# EasyEDA Pro project LUME_PEN_EasyEDA_Project_V1.2_2026-06-28.epro, board LUME_PCB_PANEL
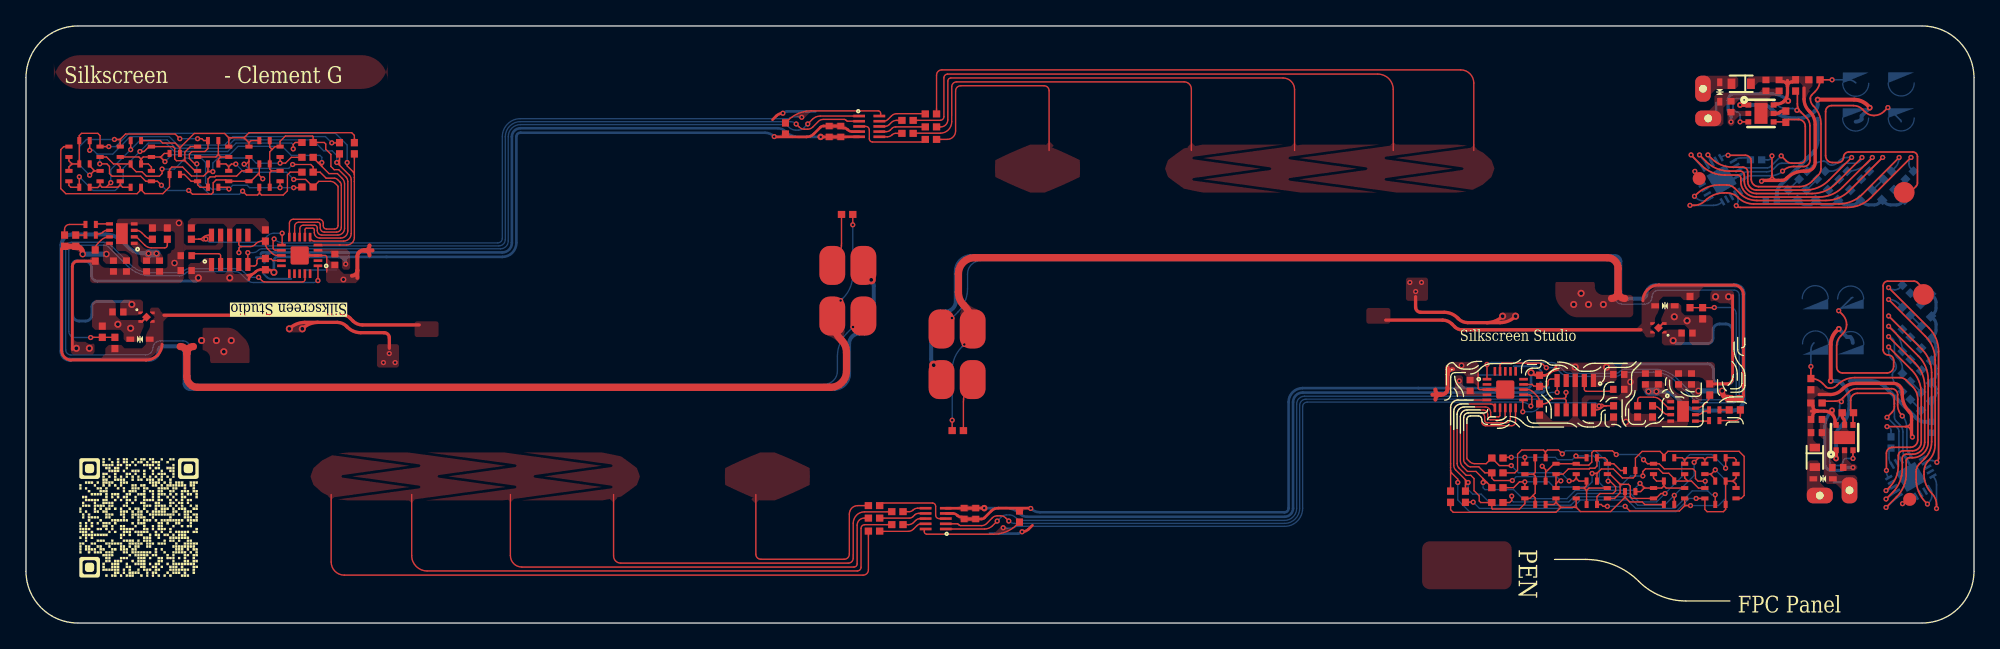
[diagram p9: board, top side]
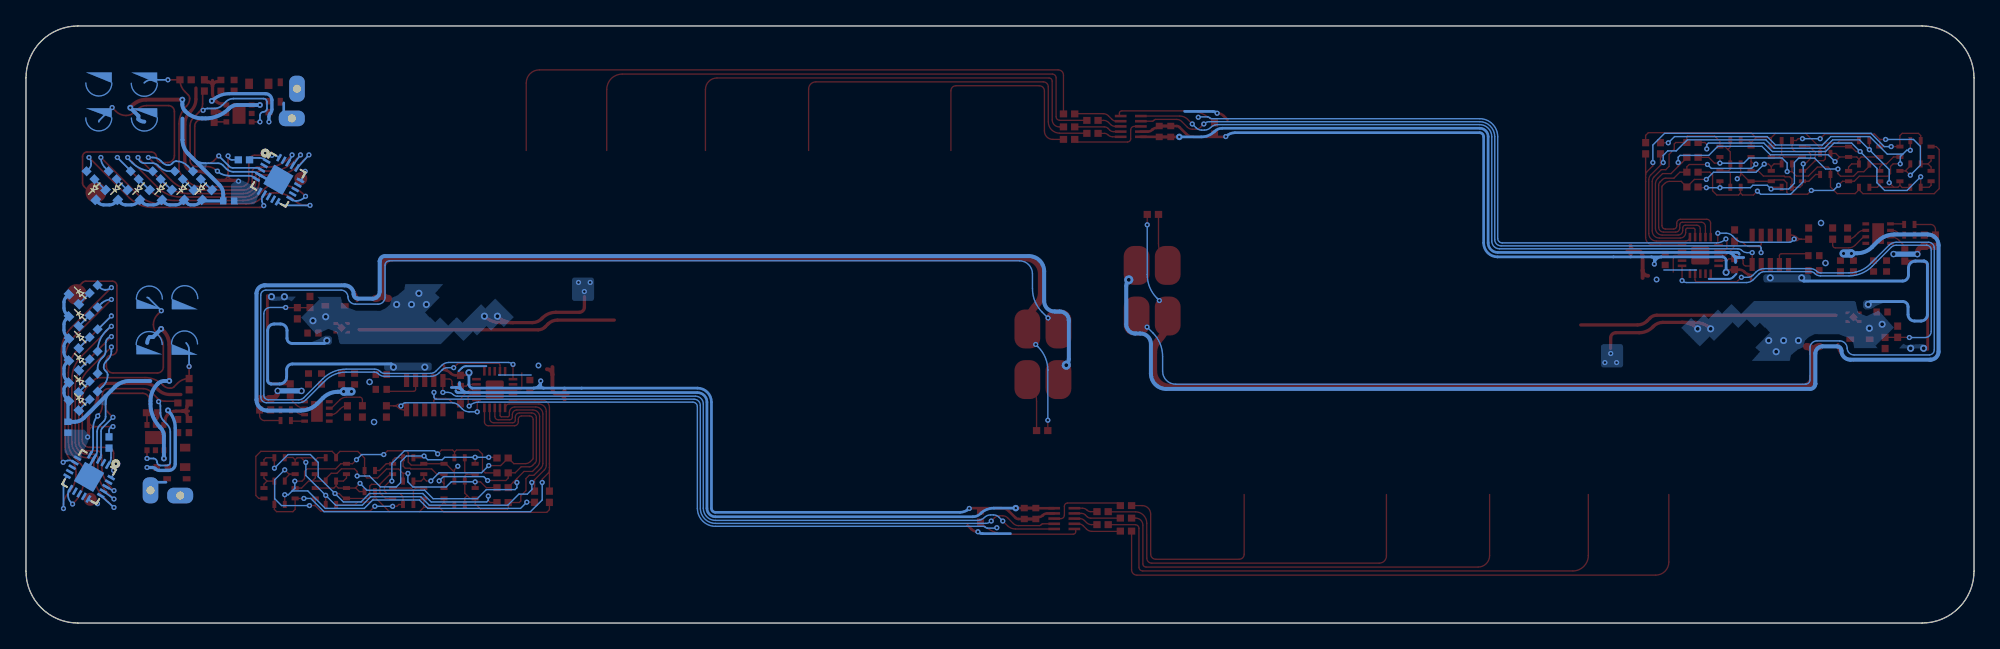
[diagram p10: board, bottom side, seen from below]

Outline 150 x 46 mm; copper layers: Top Layer, Bottom Layer. Coordinates in mm from the lower left corner of the outline.
Outline path: 0,42 0,4 arc(1.17,1.17) 4,0 146,0 arc(148.83,1.17) 150,4 150,42 arc(148.83,44.83) 146,46 4,46 arc(1.17,44.83) 0,42
Stack: Top Layer 0.035mm / Dielectric1 1.51mm FR4 er 4.5 / Bottom Layer 0.035mm

## Design rules (mm)
template: Custom Config
spacing copperThickness1oz (default): track to track 0.127, other pairs 0.15 to 0.3
spacing copperThickness2oz: track to track 0.203, other pairs 0.152 to 0.3
track width copperThickness1oz (default): min 0.102, default 0.102, max 2.54
track width copperThickness2oz: min 0.203, default 0.254, max 2.54
differential pair differentialPair (default): width min 0.127, default 0.254, max 2.54; gap min 0.152, default 0.152
via viaSize (default): diameter min 0.35, default 0.4, max 10; hole min 0.15, default 0.2, max 6.3
pour e689 uses copperRegion1
pour e1654 uses GND pour
pour e1473 uses SENSE_TRACES
pour e12839 uses copperRegion

## Placement (name value [footprint] x y rotation side)
C1  1µF  [C0402]  12.33 28.3 180 top
C1#2  -  [C0402]  137.87 15.69 0 top
C1#3  -  [C0402]  134.99 41.42 270 top
C1#4  -  [C0402]  122.65 18 0 top
C2  100nF  [C0402]  23.78 28.01 270 top
C2#2  -  [C0402]  137.87 14.67 0 top
C2#3  -  [C0402]  133.98 41.42 270 top
C2#4  -  [C0402]  111.2 18.3 90 top
C3  100nF  [C0402]  12.33 27.15 180 top
C3#2  -  [C0402]  122.65 19.15 0 top
C3#3  -  [C0402]  146.77 15.08 90 bottom
C3#4  -  [C0402]  134.39 32.52 0 bottom
C4  -  [C0402]  139.51 11.98 180 top
C4#2  -  [C0402]  131.29 39.78 90 top
C5  4.7µF  [C0402]  9.28 27.5 270 top
C5#2  -  [C0402]  125.7 18.8 90 top
C6  4.7µF  [C0402]  127.25 18.8 90 top
C6#2  -  [C0402]  7.73 27.5 270 top
C7  100nF  [C0402]  124.7 18.8 90 top
C7#2  -  [C0402]  10.28 27.5 270 top
C8  100nF  [C0402]  128.25 18.8 90 top
C8#2  -  [C0402]  6.73 27.5 270 top
C9  100nF  [C0402]  62.74 37.87 270 top
C9#2  -  [C0402]  72.24 8.44 90 top
C10  1µF  [C0402]  61.85 37.87 270 top
C10#2  -  [C0402]  73.13 8.44 90 top
C11  1µF  [C0402]  7.08 23.97 180 top
C11#2  -  [C0402]  127.9 22.34 0 top
D1  LESD5D5.0CT1G  [SOD-523_L1.2-W0.8-LS1.6-BI]  8.78 21.87 0 top
D1#2  -  [SOD-523_L1.2-W0.8-LS1.6-BI]  126.2 24.44 180 top
D3  -  [SOD-523F_L1.7-W0.9-LS1.7-RD]  137.74 12.76 270 top
D3#2  -  [SOD-523F_L1.7-W0.9-LS1.7-RD]  132.07 41.55 180 top
LED1  XL-1005SURC  [LED0402]  4.98 29.89 180 top
LED1#2  -  [LED0402]  130 16.42 0 top
LED1#3  -  [LED0402-RD_YELLOW]  146.31 16.75 225 bottom
LED1#4  -  [LED0402-RD_YELLOW]  136.06 32.98 135 bottom
LED2  XL-1005SURC  [LED0402]  4.98 30.71 180 top
LED2#2  -  [LED0402]  130 15.6 0 top
LED2#3  -  [LED0402-RD_YELLOW]  146.31 18.14 225 bottom
LED2#4  -  [LED0402-RD_YELLOW]  137.45 32.98 135 bottom
LED3  XL-1005SURC  [LED0402]  13.21 34.44 90 top
LED3#2  -  [LED0402]  121.77 11.87 270 top
LED3#3  -  [LED0402-RD_YELLOW]  146.31 19.84 225 bottom
LED3#4  -  [LED0402-RD_YELLOW]  139.15 32.98 135 bottom
LED4  XL-1005SURC  [LED0402]  13.22 36.31 90 top
LED4#2  -  [LED0402]  121.77 10 270 top
LED4#3  -  [LED0402-RD_YELLOW]  146.31 21.54 225 bottom
LED4#4  -  [LED0402-RD_YELLOW]  140.85 32.98 135 bottom
LED5  XL-1005SURC  [LED0402]  9.66 36.31 90 top
LED5#2  -  [LED0402]  125.32 10 270 top
LED5#3  -  [LED0402-RD_YELLOW]  146.31 23.24 225 bottom
LED5#4  -  [LED0402-RD_YELLOW]  142.55 32.98 135 bottom
LED6  XL-1005SURC  [LED0402]  4.51 33.57 180 top
LED6#2  -  [LED0402]  130.47 12.73 0 top
LED6#3  -  [LED0402-RD_YELLOW]  146.31 24.94 225 bottom
LED6#4  -  [LED0402-RD_YELLOW]  144.25 32.98 135 bottom
LED7  XL-1005SURC  [LED0402]  3.3 34.44 270 top
LED7#2  -  [LED0402]  131.68 11.87 90 top
LED8  XL-1005SURC  [LED0402]  18.37 33.57 180 top
LED8#2  -  [LED0402]  116.61 12.74 0 top
LED9  XL-1005SURC  [LED0402]  14.41 37.17 180 top
LED9#2  -  [LED0402]  120.57 9.14 0 top
LED10  XL-1005SURC  [LED0402]  7.26 36.31 90 top
LED10#2  -  [LED0402]  127.72 10 270 top
LED11  XL-1005SURC  [LED0402]  5.71 34.43 90 top
LED11#2  -  [LED0402]  129.27 11.87 270 top
LED12  XL-1005SURC  [LED0402]  4.51 35.37 0 top
LED12#2  -  [LED0402]  130.47 10.94 180 top
LED13  XL-1005SURC  [LED0402]  19.56 34.44 270 top
LED13#2  -  [LED0402]  115.42 11.87 90 top
LED14  XL-1005SURC  [LED0402]  14.41 33.57 0 top
LED14#2  -  [LED0402]  120.57 12.74 180 top
LED15  XL-1005SURC  [LED0402]  8.46 35.37 180 top
LED15#2  -  [LED0402]  126.52 10.94 0 top
LED16  XL-1005SURC  [LED0402]  7.26 34.44 90 top
LED16#2  -  [LED0402]  127.72 11.87 270 top
LED17  XL-1005SURC  [LED0402]  5.71 36.31 270 top
LED17#2  -  [LED0402]  129.27 10 90 top
LED18  XL-1005SURC  [LED0402]  19.57 36.31 270 top
LED18#2  -  [LED0402]  115.41 10 90 top
LED19  XL-1005SURC  [LED0402]  11.45 34.56 180 top
LED19#2  -  [LED0402]  123.53 11.75 0 top
LED20  XL-1005SURC  [LED0402]  14.41 35.37 180 top
LED20#2  -  [LED0402]  120.57 10.94 0 top
LED21  XL-1005SURC  [LED0402]  8.46 33.57 0 top
LED21#2  -  [LED0402]  126.52 12.74 180 top
LED22  XL-1005SURC  [LED0402]  3.31 36.31 90 top
LED22#2  -  [LED0402]  131.67 10 270 top
LED23  XL-1005SURC  [LED0402]  18.37 35.37 180 top
LED23#2  -  [LED0402]  116.61 10.94 0 top
LED24  XL-1005SURC  [LED0402]  17.17 34.44 270 top
LED24#2  -  [LED0402]  117.81 11.87 90 top
LED25  XL-1005SURC  [LED0402]  15.61 34.44 270 top
LED25#2  -  [LED0402]  119.37 11.87 90 top
LED26  XL-1005SURC  [LED0402]  9.66 34.43 270 top
LED26#2  -  [LED0402]  125.32 11.87 90 top
LED27  XL-1005SURC  [LED0402]  4.51 37.17 0 top
LED27#2  -  [LED0402]  130.47 9.14 180 top
LED28  XL-1005SURC  [LED0402]  18.37 37.17 180 top
LED28#2  -  [LED0402]  116.61 9.14 0 top
LED29  XL-1005SURC  [LED0402]  17.17 36.31 90 top
LED29#2  -  [LED0402]  117.81 10 270 top
LED30  XL-1005SURC  [LED0402]  15.61 36.31 90 top
LED30#2  -  [LED0402]  119.37 10 270 top
LED31  XL-1005SURC  [LED0402]  11.45 36.18 0 top
LED31#2  -  [LED0402]  123.53 10.13 180 top
LED32  XL-1005SURC  [LED0402]  8.46 37.17 0 top
LED32#2  -  [LED0402]  126.52 9.14 180 top
NOREF  -  [Pad_e530]  70.5 18.75 0 top
NOREF#2  -  [Pad_e528]  72.89 18.75 0 top
NOREF#3  -  [Pad_e533]  70.5 22.65 0 top
NOREF#4  -  [Pad_e13341]  138.13 9.82 270 top
NOREF#5  -  [Pad_e1524]  140.89 41.5 0 top
NOREF#6  -  [Pad_e1520]  128.84 34.24 0 top
NOREF#7  -  [Pad_e1530]  129.13 41.17 180 top
NOREF#8  -  [Pad_e12764]  64.48 23.65 180 top
NOREF#9  -  [Pad_e14023]  140.5 25.09 270 top
NOREF#10  -  [Pad_e1529]  144.39 41.52 0 top
NOREF#11  -  [Pad_e1521]  144.62 33.18 0 top
NOREF#12  -  [Pad_e1525]  140.89 38.78 180 top
NOREF#13  -  [Pad_e14021]  137.79 21.59 90 top
NOREF#14  -  [Pad_e1526]  144.39 38.79 180 top
NOREF#15  -  [Pad_e1531]  129.53 38.88 90 top
NOREF#16  -  [Pad_e14020]  137.77 25.08 90 top
NOREF#17  -  [Pad_e12763]  64.48 27.55 180 top
NOREF#18  -  [Pad_e14022]  140.51 21.58 270 top
NOREF#19  -  [Pad_e13342]  140.41 10.22 180 top
NOREF#20  -  [Pad_e12765]  62.09 23.65 180 top
NOREF#21  -  [Pad_e531]  72.89 22.65 0 top
NOREF#22  -  [Pad_e13336]  146.11 25.31 90 top
NOREF#23  -  [Pad_e12766]  62.09 27.55 180 top
NOREF#24  -  [Pad_e13335]  145.05 9.53 90 top
R1  4.7K  [R0402]  18.44 27.65 270 top
R1#2  -  [R0402]  137.87 16.95 180 top
R1#3  -  [R0402]  116.55 18.65 90 top
R1#4  -  [R0402]  136.26 41.42 90 top
R2  4.7K  [R0402]  18.44 29.85 90 top
R2#2  -  [R0402]  140.28 16.2 0 top
R2#3  -  [R0402]  135.51 39.01 270 top
R2#4  -  [R0402]  116.55 16.45 270 top
R3  20K  [R0402]  12.73 30 90 top
R3#2  -  [R0402]  122.25 16.3 270 top
R3#3  -  [R0402]  143.61 13.91 90 bottom
R3#4  -  [R0402]  133.22 35.68 0 bottom
R4  24K  [R0402]  10.88 30 270 top
R4#2  -  [R0402]  124.1 16.3 90 top
R4#3  -  [R0402]  144.79 17.53 315 bottom
R4#4  -  [R0402]  136.84 34.5 225 bottom
R5  27K  [R0402]  5.33 28.32 90 top
R5#2  -  [R0402]  129.65 17.99 270 top
R5#3  -  [R0402]  144.79 18.92 315 bottom
R5#4  -  [R0402]  138.23 34.5 225 bottom
R6  10K  [R0402]  9.73 30 270 top
R6#2  -  [R0402]  125.25 16.3 90 top
R6#3  -  [R0402]  144.79 20.62 315 bottom
R6#4  -  [R0402]  139.93 34.5 225 bottom
R7  10K  [R0402]  3.83 29.46 270 top
R7#2  -  [R0402]  131.15 16.85 90 top
R7#3  -  [R0402]  144.79 22.32 315 bottom
R7#4  -  [R0402]  141.63 34.5 225 bottom
R8  10K  [R0402]  2.97 29.46 270 top
R8#2  -  [R0402]  132.01 16.85 90 top
R8#3  -  [R0402]  144.79 24.02 315 bottom
R8#4  -  [R0402]  143.33 34.5 225 bottom
R9  0  [R0402]  69.68 39.22 180 top
R9#2  -  [R0402]  65.3 7.08 0 top
R9#3  -  [R0402]  144.79 25.72 315 bottom
R9#4  -  [R0402]  145.03 34.5 225 bottom
R10  0  [R0402]  67.88 38.73 180 top
R10#2  -  [R0402]  137.44 18.4 270 top
R10#3  -  [R0402]  137.71 41.85 180 top
R10#4  -  [R0402]  67.1 7.58 0 top
R11  0  [R0402]  69.68 38.22 180 top
R11#2  -  [R0402]  65.3 8.08 0 top
R12  0  [R0402]  67.88 37.73 180 top
R12#2  -  [R0402]  67.1 8.58 0 top
R13  0  [R0402]  69.68 37.26 0 top
R13#2  -  [R0402]  65.3 9.05 180 top
R14  20K  [R0402]  58.48 38.1 270 top
R14#2  -  [R0402]  76.5 8.21 90 top
R15  680  [R0402]  21.68 37.02 0 top
R15#2  -  [R0402]  113.3 9.28 180 top
R16  680  [R0402]  21.68 34.74 0 top
R16#2  -  [R0402]  113.3 11.57 180 top
R17  680  [R0402]  21.68 33.59 0 top
R17#2  -  [R0402]  113.3 12.71 180 top
R18  680  [R0402]  21.68 35.88 0 top
R18#2  -  [R0402]  113.3 10.43 180 top
R19  680  [R0402]  24.14 36.58 270 top
R19#2  -  [R0402]  110.84 9.73 90 top
R20  680  [R0402]  25.29 36.58 270 top
R20#2  -  [R0402]  109.69 9.73 90 top
R21  100K  [R0402]  6.85 21.58 270 top
R21#2  -  [R0402]  128.13 24.73 90 top
R22  200K  [R0402]  5.88 22.44 270 top
R22#2  -  [R0402]  129.1 23.86 90 top
R23  20K  [R0402]  63.23 31.48 180 top
R23#2  -  [R0402]  71.75 14.83 0 top
TVS1  -  [SOD-523_L1.2-W0.8-LS1.6-BI]  138.38 11.11 180 top
TVS1#2  -  [SOD-523_L1.2-W0.8-LS1.6-BI]  130.42 40.91 90 top
U1  RX8111CE B  [OSC-SMD_10P-L3.2-W2.5-BL-1]  15.69 28.75 0 top
U1#2  -  [OSC-SMD_10P-L3.2-W2.5-BL-1]  119.3 17.55 180 top
U1#3  -  [WSON-6_L2.0-W2.0-P0.65-BL-EP]  140.03 14.29 0 top
U1#4  -  [WSON-6_L2.0-W2.0-P0.65-BL-EP]  133.59 39.26 270 top
U2  ATTINY1616-MNR  [QFN-20_L3.0-W3.0-P0.40-BL-EP1.7]  113.9 17.99 270 top
U2#2  -  [QFN-20_L3.0-W3.0-P0.40-BL-EP1.7]  21.08 28.32 90 top
U2#3  -  [QFN-20_L3.0-W3.0-P0.40-TL-EP1.7]  145.14 11.26 300 bottom
U2#4  -  [QFN-20_L3.0-W3.0-P0.40-TL-EP1.7]  130.56 34.15 210 bottom
U3  BQ25170DSGR  [WSON-8_L2.0-W2.0-P0.50-TL-EP]  7.38 30 180 top
U3#2  -  [WSON-8_L2.0-W2.0-P0.50-TL-EP]  127.6 16.3 0 top
U4  -  [AW93105DNR]  64.93 38.26 270 top
U4#2  -  [AW93105DNR]  70.05 8.05 90 top
U5  LP5907SNX-3.0/NOPB  [X2SON-4_L1.0-W1.0-P0.65-BL-EP]  9.28 23.57 270 top
U5#2  -  [X2SON-4_L1.0-W1.0-P0.65-BL-EP]  125.7 22.74 90 top

## Footprints (pads in the part's own frame, mm; a bottom-side part is the same pattern mirrored in y, then rotated)
AW93105DNR
  rect 0.2x0.905 smd: 1(-0.8,-0.777) 2(-0.4,-0.777) 3(0,-0.777) 4(0.4,-0.777) 5(0.8,-0.777) 6(0.8,0.777) 7(0.4,0.777) 8(0,0.777) 9(-0.4,0.777) 10(-0.8,0.777)
C0402
  rect 0.5x0.54 smd: 1(-0.42,0) 2(0.42,0)
LED0402
  rect 0.3x0.55 smd: 1(-0.4,0) 2(0.4,0)
LED0402-RD_YELLOW
  rect 0.636x0.54 smd: 1(-0.538,0) 2(0.538,0)
OSC-SMD_10P-L3.2-W2.5-BL-1
  rect 0.4x1 smd: 1(-1.4,-1.13) 2(-0.7,-1.13) 3(0,-1.13) 4(0.7,-1.13) 5(1.4,-1.13) 6(1.4,1.13) 7(0.7,1.13) 8(0,1.13) 9(-0.7,1.13) 10(-1.4,1.13)
Pad_e528
  rrect 1.988x3 smd: 2(0,0)
Pad_e530
  rrect 1.988x3 smd: 2(0,0)
Pad_e531
  rrect 1.988x3 smd: 2(0,0)
Pad_e533
  rrect 1.988x3 smd: 2(0,0)
Pad_e1520
  round 1 smd: 1(0,0)
Pad_e1521
  round 1.6 smd: 1(0,0)
Pad_e1524
  custom 2.005x1.835 smd far side: 22(0,0)
Pad_e1525
  custom 2.01x1.758 smd far side: 22(0,0)
Pad_e1526
  custom 2.005x1.751 smd far side: 22(0,0)
Pad_e1529
  custom 2.003x1.822 smd far side: 22(0,0)
Pad_e1530
  rrect 1.2x2 hole 0.6: 1(0,0)
Pad_e1531
  rrect 1.2x2 hole 0.6: 1(0,0)
Pad_e12763
  rrect 1.988x3 smd: 2(0,0)
Pad_e12764
  rrect 1.988x3 smd: 2(0,0)
Pad_e12765
  rrect 1.988x3 smd: 2(0,0)
Pad_e12766
  rrect 1.988x3 smd: 2(0,0)
Pad_e13335
  round 1 smd: 1(0,0)
Pad_e13336
  round 1.6 smd: 1(0,0)
Pad_e13341
  rrect 1.2x2 hole 0.6: 1(0,0)
Pad_e13342
  rrect 1.2x2 hole 0.6: 1(0,0)
Pad_e14020
  custom 1.822x2.003 smd far side: 22(0,0)
Pad_e14021
  custom 1.836x2.005 smd far side: 22(0,0)
Pad_e14022
  custom 1.758x2.01 smd far side: 22(0,0)
Pad_e14023
  custom 1.751x2.005 smd far side: 22(0,0)
QFN-20_L3.0-W3.0-P0.40-BL-EP1.7
  rect 0.2x0.665 smd: 1(-0.8,-1.407) 2(-0.4,-1.407) 3(0,-1.407) 4(0.4,-1.407) 5(0.8,-1.407) 11(0.8,1.407) 12(0.4,1.407) 13(0,1.407) 14(-0.4,1.407) 15(-0.8,1.407)
  rect 0.665x0.2 smd: 6(1.407,-0.8) 7(1.407,-0.4) 8(1.407,0) 9(1.407,0.4) 10(1.407,0.8) 16(-1.407,0.8) 17(-1.407,0.4) 18(-1.407,0) 19(-1.407,-0.4) 20(-1.407,-0.8)
  rrect 1.4x1.4 smd: 21(0,0)
QFN-20_L3.0-W3.0-P0.40-TL-EP1.7
  rect 0.6x0.2 smd: 1(-1.5,0.8) 2(-1.5,0.401) 3(-1.5,0) 4(-1.5,-0.4) 5(-1.5,-0.8) 11(1.5,-0.8) 12(1.5,-0.4) 13(1.5,0) 14(1.5,0.401) 15(1.5,0.8)
  rect 0.2x0.6 smd: 6(-0.8,-1.5) 7(-0.4,-1.5) 8(0,-1.5) 9(0.4,-1.5) 10(0.799,-1.5) 16(0.8,1.5) 17(0.4,1.5) 18(0,1.5) 19(-0.4,1.5) 20(-0.8,1.5)
  rect 1.7x1.7 smd: 21(0,0)
R0402
  rect 0.566x0.54 smd: 1(-0.433,0) 2(0.433,0)
SOD-523_L1.2-W0.8-LS1.6-BI
  rect 0.6x0.4 smd: 1(-0.75,0) 2(0.75,0)
SOD-523F_L1.7-W0.9-LS1.7-RD
  rect 0.6x0.8 smd: 1(-0.75,0) 2(0.75,0)
WSON-6_L2.0-W2.0-P0.65-BL-EP
  rect 0.4x0.45 smd: 1(-0.65,-0.975) 2(0,-0.975) 3(0.65,-0.975) 4(0.65,0.975) 5(0,0.975) 6(-0.65,0.975)
  rect 1.6x1 smd: 7(0,0)
WSON-8_L2.0-W2.0-P0.50-TL-EP
  rect 0.521x0.25 smd: 1(-0.95,0.75) 2(-0.95,0.25) 3(-0.95,-0.25) 4(-0.95,-0.75) 5(0.95,-0.75) 6(0.95,-0.25) 7(0.95,0.25) 8(0.95,0.75)
  rect 0.9x1.6 smd: 9(0,0)
X2SON-4_L1.0-W1.0-P0.65-BL-EP
  custom 0.21x0.36 smd: 1(-0.33,-0.45) 2(0.33,-0.45) 3(0.33,0.45) 4(-0.33,0.45)
  rect 0.48x0.48 smd rot 135: 5(0,0)

## Nets
3.0V: C2.1 C2#4.1 C3.1 C3#2.1 C9.1 C9#2.1 C10.1 C10#2.1 C11.1 C11#2.1 R1.2 R1#3.2 R2.2 R2#4.2 R3.2 R3#2.2 R14.2 R14#2.2 U1.1 U1.3 U1.8 U1#2.1 U1#2.3 U1#2.8 U2.4 U2#2.4 U4.4 U4#2.4 U5.1 U5#2.1
5V_IN: D3.2 D3#2.2 NOREF#4.1 NOREF#7.1 TVS1.2 TVS1#2.2
5V_POGO: NOREF#12.22 NOREF#18.22 U1#3.1 U1#4.1
5V_POGO_EN: R2#2.2 R2#3.2 U1#3.4 U1#4.4 U2#3.3 U2#4.3
GND: C1.2 C1#2.2 C1#3.2 C1#4.2 C2.2 C2#2.2 C2#3.2 C2#4.2 C3.2 C3#2.2 C3#3.2 C3#4.2 C4.2 C4#2.2 C5.2 C5#2.2 C6.2 C6#2.2 C7.2 C7#2.2 C8.2 C8#2.2 C9.2 C9#2.2 C10.2 C10#2.2 C11.2 C11#2.2 D1.1 D1#2.1 LED1#3.1 LED1#4.1 LED2#3.1 LED2#4.1 LED3#3.1 LED3#4.1 LED4#3.1 LED4#4.1 LED5#3.1 LED5#4.1 LED6#3.1 LED6#4.1 NOREF#10.22 NOREF#15.1 NOREF#16.22 NOREF#19.1 NOREF#20.2 NOREF#21.2 R2#2.1 R2#3.1 R4.1 R4#2.1 R5.1 R5#2.1 R6.1 R6#2.1 R22.1 R22#2.1 R23.1 R23#2.1 TVS1.1 TVS1#2.1 U1.9 U1#2.9 U1#3.5 U1#3.7 U1#4.5 U1#4.7 U2.3 U2.21 U2#2.3 U2#2.21 U2#3.4 U2#3.21 U2#4.4 U2#4.21 U3.4 U3.9 U3#2.4 U3#2.9 U4.5 U4#2.5 U5.2 U5.5 U5#2.2 U5#2.5
VBAT.SENSE: R21.1 R21#2.1 R22.2 R22#2.2 U2.1 U2#2.1
VBUS: C1#2.1 C1#3.1 C2#2.1 C2#3.1 C3#3.1 C3#4.1 C4.1 C4#2.1 D3.1 D3#2.1 R1#2.2 R1#4.2 R3#3.2 R3#4.2 R10#2.2 R10#3.2 U1#3.2 U1#3.6 U1#4.2 U1#4.6 U2#3.6 U2#4.6
VCC: C6.1 C6#2.1 C8.1 C8#2.1 D1.2 D1#2.2 R7.2 R7#2.2 R8.2 R8#2.2 R21.2 R21#2.2 U3.8 U3#2.8 U5.3 U5.4 U5#2.3 U5#2.4
VIN: C5.1 C5#2.1 C7.1 C7#2.1 NOREF.2 NOREF#17.2 U3.1 U3#2.1
AW.NINT: R14.1 R14#2.1 U2.12 U2#2.12 U4.10 U4#2.10
C0: R11.1 R11#2.1
C1: R12.1 R12#2.1
C2: R13.2 R13#2.2
C3: R10.1 R10#4.1
C4: R9.1 R9#2.1
EVIN: U1.6 U1#2.6
L1: LED8.1 LED8#2.1 LED13.1 LED13#2.1 LED18.1 LED18#2.1 LED23.1 LED23#2.1 LED28.1 LED28#2.1 R15.2 R15#2.2 U2.7 U2#2.7
L2: LED3.1 LED3#2.1 LED14.1 LED14#2.1 LED19.1 LED19#2.1 LED24.1 LED24#2.1 LED29.1 LED29#2.1 R16.2 R16#2.2 U2.9 U2#2.9
L3: LED4.1 LED4#2.1 LED9.1 LED9#2.1 LED20.1 LED20#2.1 LED25.1 LED25#2.1 LED30.1 LED30#2.1 R17.2 R17#2.2 U2.10 U2#2.10
L4: LED5.1 LED5#2.1 LED10.1 LED10#2.1 LED15.1 LED15#2.1 LED26.1 LED26#2.1 LED31.1 LED31#2.1 R18.2 R18#2.2 U2.8 U2#2.8
L5: LED6.1 LED6#2.1 LED11.1 LED11#2.1 LED16.1 LED16#2.1 LED21.1 LED21#2.1 LED32.1 LED32#2.1 R19.2 R19#2.2 U2.6 U2#2.6
L6: LED7.1 LED7#2.1 LED12.1 LED12#2.1 LED17.1 LED17#2.1 LED22.1 LED22#2.1 LED27.1 LED27#2.1 R20.2 R20#2.2 U2.5 U2#2.5
LED_R: R4#3.1 R4#4.1 U2#3.18 U2#4.18
LED_W1: R9#3.1 R9#4.1 U2#3.7 U2#4.7
LED_W2: R5#3.1 R5#4.1 U2#3.17 U2#4.17
LED_W3: R6#3.1 R6#4.1 U2#3.16 U2#4.16
LED_W4: R7#3.1 R7#4.1 U2#3.11 U2#4.11
LED_W5: R8#3.1 R8#4.1 U2#3.10 U2#4.10
NFAULT: R1#2.1 R1#4.1 U1#3.3 U1#4.3 U2#3.5 U2#4.5
RTC.NINT: R3.1 R3#2.1 U1.10 U1#2.10 U2.11 U2#2.11
RTC.VOUT: C1.1 C1#4.1 U1.2 U1#2.2
SCL: R1.1 R1#3.1 U1.5 U1#2.5 U2.14 U2#2.14 U4.1 U4#2.1
SDA: R2.1 R2#4.1 U1.7 U1#2.7 U2.13 U2#2.13 U4.2 U4#2.2
SENSE: NOREF#2.2 NOREF#5.22 NOREF#13.22 NOREF#23.2 R10#2.1 R10#3.1 R23.2 R23#2.2 U2#3.20 U2#4.20
SWIO: NOREF#6.1 NOREF#24.1 U2#3.15 U2#4.15
UPDI: NOREF#3.2 NOREF#8.2 NOREF#9.22 NOREF#11.1 NOREF#14.22 NOREF#22.1 U2.19 U2#2.19
VSET: R5.2 R5#2.2 U3.7 U3#2.7
$1N881: R3#3.1 R3#4.1 U2#3.1 U2#4.1
$1N1138: LED6#3.2 LED6#4.2 R9#3.2 R9#4.2
$1N1214: LED2#3.2 LED2#4.2 R5#3.2 R5#4.2
$1N1287: LED3#3.2 LED3#4.2 R6#3.2 R6#4.2
$1N1308: R4.2 R4#2.2 U3.2 U3#2.2
$1N1353: R6.2 R6#2.2 U3.3 U3#2.3
$1N1360: LED4#3.2 LED4#4.2 R7#3.2 R7#4.2
$1N1433: LED5#3.2 LED5#4.2 R8#3.2 R8#4.2
$1N1609: LED1#3.2 LED1#4.2 R4#3.2 R4#4.2
$1N1786: LED1.2 LED1#2.2 R7.1 R7#2.1
$1N1791: LED2.2 LED2#2.2 R8.1 R8#2.1
$1N1797: LED2.1 LED2#2.1 U3.5 U3#2.5
$1N1804: LED1.1 LED1#2.1 U3.6 U3#2.6
$1N2356: R12.2 R12#2.2 U4.6 U4#2.6
$1N2362: R11.2 R11#2.2 U4.7 U4#2.7
$1N2368: R10.2 R10#4.2 U4.8 U4#2.8
$1N2375: R9.2 R9#2.2 U4.9 U4#2.9
$1N2409: R13.1 R13#2.1 U4.3 U4#2.3
$1N4813: LED3.2 LED3#2.2 LED4.2 LED4#2.2 LED5.2 LED5#2.2 LED6.2 LED6#2.2 LED7.2 LED7#2.2 R15.1 R15#2.1
$1N4816: LED8.2 LED8#2.2 LED9.2 LED9#2.2 LED10.2 LED10#2.2 LED11.2 LED11#2.2 LED12.2 LED12#2.2 R16.1 R16#2.1
$1N4817: LED18.2 LED18#2.2 LED19.2 LED19#2.2 LED20.2 LED20#2.2 LED21.2 LED21#2.2 LED22.2 LED22#2.2 R18.1 R18#2.1
$1N4818: LED13.2 LED13#2.2 LED14.2 LED14#2.2 LED15.2 LED15#2.2 LED16.2 LED16#2.2 LED17.2 LED17#2.2 R17.1 R17#2.1
$1N4825: LED23.2 LED23#2.2 LED24.2 LED24#2.2 LED25.2 LED25#2.2 LED26.2 LED26#2.2 LED27.2 LED27#2.2 R19.1 R19#2.1
$1N5378: LED28.2 LED28#2.2 LED29.2 LED29#2.2 LED30.2 LED30#2.2 LED31.2 LED31#2.2 LED32.2 LED32#2.2 R20.1 R20#2.1

Pads without a net: U1 4; U1#2 4; U2 2 15 16 17 18 20; U2#2 2 15 16 17 18 20; U2#3 2 8 9 12 13 14 19; U2#4 2 8 9 12 13 14 19

## Via types
v1: diameter 0.55, hole 0.3, Top Layer to Bottom Layer, 28 vias
v2: diameter 0.4, hole 0.2, Top Layer to Bottom Layer, 150 vias
v3: diameter 0.5, hole 0.3, Top Layer to Bottom Layer, 8 vias
v4: diameter 0.45, hole 0.25, Top Layer to Bottom Layer, 6 vias
v5: diameter 0.5, hole 0.2, Top Layer to Bottom Layer, 2 vias
v6: diameter 0.7, hole 0.3, Top Layer to Bottom Layer, 2 vias
v7: diameter 0.45, hole 0.2, Top Layer to Bottom Layer, 8 vias

## Routing (per net, layer and track width the routed paths; a pad name or vN(x,y) marks a point on that pad's centre or on a via; arc(x,y) is an arc through that point)
3.0V: length 161.3
  Top Layer w0.201: U4.4 63.62,37.86 arc(63.44,37.9) 63.28,38 63.27,38.01 arc(63.12,38.11) 62.94,38.15 ; U4#2.4 71.36,8.45 arc(71.55,8.41) 71.7,8.31 71.71,8.29 arc(71.86,8.19) 72.04,8.16
  Top Layer w0.203: 17.4,26.87 17.28,26.74 arc(17.19,26.61) 17.16,26.46 ; 17.4,26.87 arc(17.54,26.94) 17.67,27.04 17.69,27.07 arc(17.86,27.18) 18.06,27.22 R1.2 18.61,27.22 arc(18.87,27.17) v1(19.09,27.02) ; 17.4,26.87 arc(17.24,26.81) 17.07,26.8 ; C10#2.1 73.58,8.02 arc(73.7,8.04) 73.8,8.11 74.32,8.62 arc(74.57,8.79) 74.87,8.85 77.3,8.85 arc(77.34,8.85) v2(77.37,8.83) ; C10.1 61.4,38.29 arc(61.28,38.27) 61.18,38.2 60.67,37.69 arc(60.41,37.51) 60.11,37.45 57.68,37.45 arc(57.64,37.46) v2(57.61,37.48) ; 117.58,19.44 117.7,19.57 arc(117.79,19.7) 117.82,19.85 ; 117.58,19.44 arc(117.74,19.49) 117.91,19.51 ; 117.58,19.44 arc(117.44,19.36) 117.31,19.26 117.29,19.24 arc(117.12,19.13) 116.92,19.09 R1#3.2 116.37,19.09 arc(116.11,19.14) v1(115.89,19.29)
  Top Layer w0.254: C10.1 C9.1 ; C10#2.1 C9#2.1
  Bottom Layer w0.203: v1(115.89,19.29) 115.89,18.39 arc(115.81,18.19) 115.6,18.1 110.92,18.1 ; 24.84,28.21 26.42,28.21 arc(26.44,28.21) 26.47,28.21 27.74,28.21 arc(27.76,28.21) 27.78,28.21 36.68,28.21 arc(37.44,28.52) 37.76,29.29 37.76,37.46 arc(37.85,37.68) 38.07,37.78 56.9,37.78 arc(57.29,37.7) v2(57.61,37.48) ; 24.84,28.21 24.07,28.21 ; 24.84,28.21 arc(24.68,28.14) 24.62,27.98 v2(24.62,27.66) arc(24.45,28.05) 24.07,28.21 ; 24.07,28.21 19.38,28.21 arc(19.18,28.12) 19.09,27.92 v1(19.09,27.02) ; 110.92,18.1 110.14,18.1 ; 110.92,18.1 arc(110.53,18.26) v2(110.36,18.65) 110.36,18.32 arc(110.3,18.17) 110.14,18.1 ; 110.14,18.1 108.56,18.1 arc(108.54,18.1) 108.51,18.1 107.24,18.1 arc(107.22,18.1) 107.2,18.1 98.3,18.1 arc(97.54,17.78) 97.22,17.02 97.22,8.84 arc(97.13,8.62) 96.91,8.53 78.08,8.53 arc(77.69,8.61) v2(77.37,8.83)
  Bottom Layer w0.22: 130.9,23.04 130.4,23.04 arc(130.05,22.89) 129.9,22.54 129.9,21.94 arc(129.78,21.66) 129.5,21.54 127.05,21.54 arc(126.9,21.6) v1(126.83,21.76) ; 4.08,23.27 4.58,23.27 arc(4.93,23.41) 5.08,23.77 5.08,24.37 arc(5.2,24.65) 5.48,24.77 7.93,24.77 arc(8.08,24.7) v1(8.15,24.55) ; 4.09,23.27 arc(3.74,23.41) 3.59,23.77 3.59,27.63 arc(3.67,27.81) 3.85,27.89 ; 131.13,18.42 arc(131.31,18.5) 131.39,18.68 131.39,22.54 arc(131.24,22.89) 130.89,23.04
  Bottom Layer w0.221: 3.84,27.89 4.51,27.89 arc(4.89,27.73) 5.05,27.35 5.05,26.8 arc(5.18,26.48) 5.5,26.35 13.11,26.35 arc(13.23,26.44) v1(13.27,26.59) ; 131.14,18.42 130.47,18.42 arc(130.09,18.58) 129.93,18.96 129.93,19.51 arc(129.8,19.83) 129.48,19.96 121.87,19.96 arc(121.75,19.87) v1(121.71,19.72)
  vias: v1(15.69,26.59) v1(119.29,19.72)
5V_POGO: length 27.3
  Top Layer w0.3: v7(139.38,12.68) U1#3.1 ; v7(138.97,18.65) 138.97,21.46 arc(139.14,22.13) v7(139.59,22.66) ; v7(137.96,40.32) 140.77,40.32 arc(141.44,40.15) v7(141.97,39.7) ; v7(131.98,39.91) U1#4.1
  Bottom Layer w0.3: v7(141.97,39.7) 141.34,39.08 141.34,38.81 arc(141.14,38.67) 140.89,38.62 ; v7(137.96,40.32) 137.96,39.95 arc(137.91,39.68) 137.76,39.46 137.71,39.41 arc(137.12,39.02) 136.43,38.88 136.18,38.88 arc(135.21,39.07) 134.38,39.62 134.37,39.64 arc(134.07,39.84) 133.72,39.91 v7(131.98,39.91) ; v7(139.38,12.68) 139.38,14.41 arc(139.45,14.76) 139.65,15.06 139.67,15.08 arc(140.22,15.9) 140.41,16.87 140.41,17.12 arc(140.27,17.81) 139.88,18.4 139.83,18.45 arc(139.61,18.6) 139.34,18.65 v7(138.97,18.65) ; v7(139.59,22.66) 140.22,22.04 140.48,22.04 arc(140.62,21.83) 140.67,21.58
5V_POGO_EN: length 22
  Top Layer w0.127: 140.5,16.4 140.5,17.18 arc(140.65,17.55) 141.01,17.7 143.5,17.7 arc(143.76,17.59) 143.86,17.34 143.86,16.66 arc(143.82,16.43) 143.68,16.23 v2(143.3,15.85) ; U1#4.4 135.42,38.61 arc(135.47,38.6) R2#3.2 ; 135.71,38.79 136.49,38.79 arc(136.86,38.64) 137.01,38.28 137.01,35.79 arc(136.9,35.53) 136.64,35.43 135.97,35.43 arc(135.74,35.48) 135.54,35.61 v2(135.15,35.99) ; 140.68,15.26 140.68,16.11 arc(140.69,16.16) R2#2.2
  Bottom Layer w0.127: v2(135.15,35.99) 134.35,35.18 arc(134.23,35.1) 134.08,35.07 132.27,35.07 arc(132.05,35.03) U2#4.3 ; v2(143.3,15.85) 144.11,15.04 arc(144.19,14.92) 144.22,14.78 144.22,12.96 arc(144.26,12.74) 144.39,12.56
GND: length 376.9
  Top Layer w0.102: 111.82,19.26 111.82,18.12 arc(111.86,18.02) 111.95,17.99 112.49,17.99 ; 23.16,27.04 23.16,28.19 arc(23.12,28.28) 23.03,28.32 22.49,28.32 ; R23#2.1 v2(71.32,15.63) ; R23.1 v2(63.66,30.68)
  Top Layer w0.14: U5#2.5 126.03,23.07 126.2,23.07 ; 8.78,23.24 8.95,23.24 U5.5
  Top Layer w0.201: U4.5 62.76,37.46 arc(62.75,37.46) C9.2 ; U4#2.5 72.22,8.85 arc(72.23,8.85) C9#2.2 ; 113.89,17.99 112.49,17.99 ; 21.09,28.32 22.49,28.32
  Top Layer w0.203: C10#2.2 73.78,8.86 arc(73.78,8.86) v5(73.79,8.85) ; 57.48,38.78 57.77,39.06 arc(58,39.22) v2(58.28,39.28) ; C10.2 61.2,37.45 arc(61.2,37.45) v5(61.19,37.45) ; 77.5,7.53 77.21,7.24 arc(76.98,7.09) v2(76.7,7.03)
  Top Layer w0.22: 131.41,25.23 131.41,18.85 arc(131.29,18.55) 130.99,18.42 R5#2.1 ; 3.57,21.08 3.57,27.46 arc(3.69,27.76) 3.99,27.88 R5.1
  Top Layer w0.254: U1#4.5 134.84,39.26 arc(134.94,39.28) 135.03,39.34 arc(135.14,39.41) 135.27,39.44 R2#3.1 ; R2#2.1 139.85,15.97 arc(139.88,15.83) 139.95,15.72 arc(140.01,15.63) 140.03,15.53 140.03,15.26 ; 27.98,21.17 27.98,21.97 arc(27.86,22.25) 27.58,22.37 25.78,22.37 arc(25.23,22.48) 24.76,22.79 24.68,22.87 arc(24.35,23.09) 23.97,23.16 22.48,23.16 ; 112.5,23.14 111.02,23.14 arc(110.63,23.22) 110.3,23.44 110.22,23.52 arc(109.75,23.83) 109.2,23.94 107.4,23.94 arc(107.12,24.06) 107,24.34 107,25.14 ; 112.5,23.14 113.5,23.14 arc(114.15,23.27) v1(114.7,23.64) ; 112.5,23.14 arc(113.15,23.27) v1(113.7,23.64) ; C10#2.2 C9#2.2 ; C10.2 C9.2 ; 22.48,23.16 21.48,23.16 arc(20.83,23.03) v1(20.28,22.67) ; 22.48,23.16 arc(21.83,23.03) v1(21.28,22.67)
  Top Layer w0.305: 109.46,19.13 109.46,18.06 arc(109.33,17.74) 109,17.6 108.91,17.6 ; 109.46,19.13 109.46,19.72 ; 109.46,19.13 arc(109.59,19.43) 109.88,19.55 ; 25.52,27.17 25.52,28.24 arc(25.65,28.57) 25.98,28.71 26.07,28.71 ; 25.52,27.17 25.52,26.59 ; 25.52,27.17 arc(25.39,26.88) 25.1,26.75 ; 108.91,17.6 108.3,17.6 ; 108.91,17.6 arc(108.64,17.49) 108.53,17.21 ; 108.91,17.6 arc(108.64,17.71) 108.53,17.99 ; 26.07,28.71 26.68,28.71 ; 26.07,28.71 arc(26.34,28.59) 26.45,28.32 ; 26.07,28.71 arc(26.34,28.82) 26.45,29.09
  Top Layer w0.559: NOREF#21.2 72.89,22.82 arc(72.71,23.73) 72.2,24.5 arc(71.9,24.94) 71.8,25.47 71.8,26.9 arc(72.17,27.78) 73.05,28.15 121.77,28.15 arc(122.35,27.9) 122.6,27.32 122.6,25.51 ; NOREF#20.2 62.09,23.48 arc(62.27,22.58) 62.78,21.81 arc(63.08,21.36) 63.18,20.84 63.18,19.41 arc(62.82,18.52) 61.93,18.16 13.21,18.16 arc(12.63,18.4) 12.38,18.99 12.38,20.79 ; 12.38,20.79 arc(12.24,21.15) 11.88,21.3 ; 12.38,20.79 arc(12.53,21.15) 12.89,21.3 ; 122.6,25.51 arc(122.45,25.15) 122.09,25.01 ; 122.6,25.51 arc(122.74,25.15) 123.1,25.01
  Bottom Layer w0.102: v2(62.73,24.84) 62.92,25.03 arc(63.47,25.86) 63.66,26.83 v2(63.66,30.68) ; v2(71.32,15.63) 71.32,19.48 arc(71.51,20.45) 72.06,21.27 v2(72.25,21.46) ; 113.61,19.11 111.1,19.11 ; 21.37,27.2 23.88,27.2
  Bottom Layer w0.127: 143.87,17.47 143.87,16.87 ; 143.87,16.87 143.87,15.9 arc(143.91,15.7) 144.01,15.54 144.31,15.25 arc(144.47,15.01) 144.52,14.73 144.52,13.26 arc(144.58,12.99) 144.73,12.76 ; 143.87,16.87 arc(143.76,17.43) 143.44,17.9 ; 136.17,35.42 135.2,35.42 arc(135.01,35.38) 134.85,35.28 134.56,34.98 arc(134.32,34.82) 134.03,34.77 132.57,34.77 arc(132.29,34.71) 132.06,34.56 ; 136.17,35.42 136.78,35.42 ; 136.17,35.42 arc(136.73,35.53) 137.21,35.85
  Bottom Layer w0.152: 114.56,19.79 116.11,19.79 arc(116.29,19.76) 116.43,19.66 116.68,19.41 ; 20.42,26.52 18.87,26.52 arc(18.7,26.55) 18.55,26.65 18.3,26.9
  Bottom Layer w0.2: 139.22,10.85 139.9,10.85 140.08,11.03 ; 131.22,34.07 132.06,34.56 ; 130.15,40.07 130.15,39.39 130.33,39.21 ; 145.22,11.91 144.73,12.76
  Bottom Layer w0.203: 116.44,17.96 116.62,18.15 116.89,18.15 ; 116.44,17.96 arc(116.21,17.81) 115.95,17.76 ; 116.44,17.96 arc(116.57,18.16) 116.62,18.4 116.62,18.53 ; 116.44,17.96 arc(116.65,18.1) 116.89,18.15 ; 19.03,28.55 18.22,28.55 arc(18.12,28.51) 18.08,28.41 ; 19.03,28.55 36.68,28.55 arc(37.2,28.77) 37.41,29.29 37.41,37.46 arc(37.61,37.93) 38.07,38.12 57.89,38.12 arc(58.21,38.06) 58.48,37.88 arc(58.95,37.56) 59.5,37.45 v5(61.19,37.45) ; 19.03,28.55 arc(18.77,28.5) 18.54,28.35 ; v5(73.79,8.85) 75.48,8.85 arc(76.03,8.74) 76.5,8.43 arc(76.77,8.25) 77.09,8.19 96.91,8.19 arc(97.37,8.38) 97.57,8.84 97.57,17.02 arc(97.78,17.54) 98.3,17.76 115.95,17.76 ; 18.36,27.78 18.36,27.9 arc(18.41,28.14) 18.54,28.35 ; 116.89,18.15 117.25,18.15 ; 18.09,28.16 18.36,28.16 18.54,28.35 ; 18.09,28.16 17.73,28.16 ; 18.09,28.16 arc(18.34,28.21) 18.54,28.35 ; 115.95,17.76 116.76,17.76 arc(116.86,17.8) 116.9,17.9 ; 74.2,6.89 76.36,6.89 arc(76.54,6.93) v2(76.7,7.03) ; 60.78,39.42 58.63,39.42 arc(58.44,39.38) v2(58.28,39.28)
  Bottom Layer w0.24: C3#4.2 136.24,32.52 arc(136.35,32.54) 136.44,32.6 136.67,32.37 arc(136.84,32.26) 137.04,32.22 137.35,32.22 arc(137.44,32.23) 137.51,32.28 137.83,32.6 138.04,32.39 arc(138.24,32.26) 138.47,32.22 138.93,32.22 arc(139.13,32.26) 139.3,32.37 139.53,32.6 139.74,32.39 arc(139.94,32.26) 140.17,32.22 140.63,32.22 arc(140.83,32.26) 141,32.37 141.23,32.6 141.44,32.39 arc(141.64,32.26) 141.87,32.22 142.33,32.22 arc(142.53,32.26) 142.7,32.37 142.93,32.6 143.14,32.39 arc(143.34,32.26) 143.57,32.22 144.03,32.22 arc(144.23,32.26) 144.4,32.37 144.63,32.6 ; C3#3.2 146.77,16.94 arc(146.75,17.04) LED1#3.1 146.92,17.36 arc(147.03,17.53) 147.07,17.73 147.07,18.04 arc(147.06,18.13) 147.01,18.21 LED2#3.1 146.9,18.73 arc(147.03,18.93) 147.07,19.16 147.07,19.62 arc(147.04,19.82) 146.92,19.99 LED3#3.1 146.9,20.43 arc(147.03,20.63) 147.07,20.86 147.07,21.32 arc(147.04,21.52) 146.92,21.69 LED4#3.1 146.9,22.13 arc(147.03,22.33) 147.07,22.56 147.07,23.02 arc(147.04,23.22) 146.92,23.39 LED5#3.1 146.9,23.83 arc(147.03,24.03) 147.07,24.26 147.07,24.72 arc(147.04,24.92) 146.92,25.09 LED6#3.1
  Bottom Layer w0.3: 137.95,38.86 137.95,37.24 arc(137.83,36.64) 137.5,36.14 137.21,35.85 136.78,35.42 135.1,33.75 arc(134.89,33.42) 134.81,33.04 C3#4.2 ; 140.43,18.65 142.05,18.65 arc(142.65,18.53) 143.15,18.19 143.44,17.9 143.87,17.47 145.55,15.8 arc(145.87,15.58) 146.25,15.5 C3#3.2
  vias: v1(3.88,21.17) v1(4.88,21.17) v1(7.08,23.02) v1(8.06,22.71) v1(13.52,21.77) v1(14.66,21.77) v1(15.24,20.91) v1(15.81,21.77) v1(119.17,24.54) v1(119.74,25.4) v1(120.32,24.54) v1(121.46,24.54) v1(126.92,23.6) v1(127.9,23.29) v1(130.1,25.14) v1(131.1,25.14) v2(27.52,20.07) v2(27.97,20.77) v2(28.42,20.07) v2(106.56,26.24) v2(107.01,25.54) v2(107.46,26.24) v3(11.44,27.73) v3(11.78,30.82) v3(123.2,15.49) v3(123.54,18.57) v4(24.44,26.47) v4(110.54,19.84)
VBAT.SENSE: length 63.9
  Top Layer w0.102: 22.48,27.54 22.48,26.39 arc(22.48,26.38) v2(22.48,26.38) ; R21#2.1 R22#2.2 ; R22#2.2 129.99,24.3 arc(130,24.3) v2(130,24.31) ; R22#2.2 arc(129.11,24.31) 129.12,24.31 ; R21.1 5.88,22.01 ; 5.88,22.01 4.99,22.01 arc(4.98,22.01) v2(4.98,22) ; 5.88,22.01 arc(5.87,22) 5.86,22 ; 112.5,18.77 112.5,19.92 arc(112.5,19.92) v2(112.5,19.92)
  Bottom Layer w0.102: v2(130,24.31) 131.21,24.31 arc(131.55,24.17) 131.69,23.84 131.69,17.56 arc(131.58,17.31) 131.32,17.2 128.99,17.2 arc(128.78,17.24) 128.6,17.36 127.14,18.82 arc(126.32,19.37) 125.35,19.56 123.15,19.56 arc(122.92,19.51) 122.72,19.38 122.7,19.36 arc(122.56,19.26) 122.39,19.23 118.87,19.23 arc(118.63,19.28) 118.43,19.41 117.98,19.86 arc(117.74,20.02) 117.46,20.07 112.86,20.07 arc(112.67,20.04) v2(112.5,19.92) ; v2(4.98,22) 3.77,22 arc(3.43,22.14) 3.3,22.47 3.3,28.74 arc(3.4,29) 3.66,29.11 5.99,29.11 arc(6.2,29.07) 6.38,28.95 7.84,27.49 arc(8.66,26.94) 9.63,26.75 11.83,26.75 arc(12.06,26.79) 12.26,26.93 12.28,26.95 arc(12.42,27.04) 12.59,27.08 16.11,27.08 arc(16.35,27.03) 16.55,26.89 17,26.45 arc(17.24,26.29) 17.52,26.23 22.12,26.23 arc(22.32,26.27) v2(22.48,26.38)
VBUS: length 49.7
  Top Layer w0.127: 134.44,34.59 134.44,34.51 arc(134.34,34.27) 134.09,34.16 ; 134.44,34.59 v2(134.44,35.99) ; 134.44,34.59 arc(134.58,34.24) 134.93,34.1 ; v2(143.3,15.13) 144.7,15.13 ; 144.7,15.13 144.78,15.13 arc(145.03,15.03) 145.13,14.78 ; 144.7,15.13 arc(145.05,15.28) 145.19,15.62
  Top Layer w0.25: 137.95,16.33 138.44,16.33 ; 137.95,16.33 137.49,16.33 ; 137.95,16.33 arc(137.69,16.22) 137.58,15.95 ; 137.95,16.33 arc(137.7,16.43) 137.59,16.69 137.59,16.72 ; 134.67,39.99 134.83,39.99 arc(135.13,40.05) 135.38,40.21 arc(135.57,40.5) 135.64,40.83 ; 136.03,41.7 135.99,41.7 arc(135.74,41.59) 135.64,41.34 ; 135.64,41.8 135.64,41.34 ; 135.64,41.34 135.64,40.85 ; 135.64,41.34 arc(135.53,41.6) 135.26,41.71 ; 139.31,15.36 139.31,15.52 arc(139.25,15.82) 139.08,16.08 arc(138.79,16.26) 138.46,16.33
  Top Layer w0.254: 138.07,17.61 138.92,17.61 arc(139.41,17.7) 139.83,17.98 139.9,18.06 arc(140.35,18.36) 140.88,18.46 143.8,18.46 arc(144.28,18.26) 144.47,17.79 144.47,17.58 arc(144.61,16.88) 145.01,16.28 145.04,16.26 arc(145.15,16.09) 145.19,15.89 145.19,14.47 arc(145.2,14.39) v2(145.25,14.33) ; 136.91,41.22 136.91,40.37 arc(137.01,39.88) 137.29,39.46 137.36,39.39 arc(137.66,38.94) 137.77,38.41 137.77,35.49 arc(137.57,35.01) 137.09,34.82 136.89,34.82 arc(136.18,34.68) 135.58,34.28 135.56,34.26 arc(135.39,34.14) 135.19,34.1 133.78,34.1 arc(133.7,34.09) v2(133.64,34.04)
  Bottom Layer w0.127: R3#4.2 134.13,35.68 arc(134.35,35.77) v2(134.44,35.99) ; R3#3.2 143.61,14.83 arc(143.52,15.04) v2(143.3,15.13)
  Bottom Layer w0.25: v2(131.29,38.61) 131.29,39.02 arc(131.27,39.15) 131.19,39.26 arc(131.1,39.4) 131.06,39.57 131.06,40.28 arc(131.21,40.64) 131.57,40.78 134.34,40.78 arc(135.07,40.64) v7(135.69,40.22) ; v2(140.68,11.98) 140.27,11.98 arc(140.14,11.96) 140.03,11.88 arc(139.89,11.79) 139.72,11.76 139.01,11.76 arc(138.65,11.91) 138.51,12.27 138.51,15.04 arc(138.65,15.77) v7(139.07,16.39)
VCC: length 81.2
  Top Layer w0.22: 124.51,24.83 arc(124.86,25.68) 125.72,26.04 131.5,26.04 arc(132.02,25.82) 132.24,25.3 132.24,17.51 arc(132.17,17.35) R8#2.2 ; R8.2 arc(2.81,28.96) 2.74,28.79 2.74,21.01 arc(2.96,20.48) 3.48,20.27 9.26,20.27 arc(10.12,20.62) 10.47,21.48
  Top Layer w0.254: 10.63,23.71 24.43,23.71 arc(24.71,23.66) 24.95,23.5 25.18,23.27 arc(25.51,23.04) 25.91,22.97 30.28,22.97 ; 104.7,23.34 109.08,23.34 arc(109.47,23.26) 109.8,23.04 110.03,22.81 arc(110.27,22.65) 110.55,22.59 124.35,22.59
  Top Layer w0.399: v3(130.61,17.89) 130.61,17.82 arc(130.77,17.44) R7#2.2 ; v3(4.37,28.42) 4.37,28.49 arc(4.21,28.87) R7.2
  Top Layer w0.4: 3.96,29.02 R7.2 R8.2 ; R8#2.2 R7#2.2 131.02,17.28
  Bottom Layer w0.4: v3(130.61,17.89) 128.79,17.89 arc(128.79,17.89) v3(128.79,17.88) ; v3(4.37,28.42) 6.19,28.42 arc(6.19,28.42) v3(6.2,28.43)
VIN: length 180.4
  Bottom Layer w0.305: 12.22,18.44 12.22,20.77 arc(12.06,21.16) 11.67,21.32 10.55,21.32 arc(10.31,21.22) 10.21,20.98 arc(10.01,20.49) 9.52,20.29 3.36,20.29 ; 12.22,18.44 12.22,18.41 ; 12.22,18.44 arc(12.34,18.15) 12.62,18.04 62.21,18.04 arc(63.04,18.38) 63.38,19.21 63.38,21.51 arc(63.61,22.07) 64.18,22.31 64.58,22.31 arc(65.08,22.51) 65.28,23.01 65.28,25.97 arc(65.23,26.22) v6(65.08,26.44) ; 3.36,20.29 3.34,20.29 ; 3.36,20.29 arc(2.92,20.47) 2.73,20.92 2.73,29.11 arc(2.97,29.69) 3.56,29.94 6.13,29.94 arc(6.82,29.8) 7.41,29.41 7.85,28.97 arc(8.38,28.61) 9,28.49 9.47,28.47 ; 131.62,26.02 131.64,26.02 ; 131.62,26.02 125.46,26.02 arc(124.97,25.82) 124.77,25.33 arc(124.67,25.09) 124.43,24.99 123.31,24.99 arc(122.92,25.15) 122.76,25.54 122.76,27.87 ; 131.62,26.02 arc(132.07,25.84) 132.25,25.39 132.25,17.2 arc(132.01,16.61) 131.42,16.37 128.85,16.37 arc(128.16,16.51) 127.57,16.9 127.13,17.34 arc(126.6,17.69) 125.98,17.82 125.51,17.84 ; 122.76,27.87 122.76,27.9 ; 122.76,27.87 arc(122.64,28.15) 122.36,28.27 72.77,28.27 arc(71.94,27.93) 71.6,27.1 71.6,24.8 arc(71.37,24.23) 70.8,24 70.4,24 arc(69.91,23.79) 69.7,23.3 69.7,20.34 arc(69.75,20.08) v6(69.9,19.87)
  Bottom Layer w0.635: v4(125.54,17.84) 124.93,17.84 ; v4(9.44,28.47) v4(10.05,28.47)
  vias: v4(124.93,17.84)
AW.NINT: length 117.4
  Top Layer w0.102: 115.3,17.58 115.77,17.58 arc(115.9,17.53) 115.95,17.4 115.95,16.79 v2(115.87,16.72) ; 65.81,39.06 65.81,39.27 arc(65.75,39.41) 65.62,39.46 60.46,39.46 arc(59.49,39.27) 58.66,38.72 ; v2(19.11,29.59) 19.03,29.51 19.03,28.91 arc(19.08,28.78) 19.21,28.73 19.68,28.73 ; 69.17,7.25 69.17,7.03 arc(69.23,6.9) 69.36,6.85 74.52,6.85 arc(75.49,7.04) 76.32,7.59
  Bottom Layer w0.102: 115.87,16.67 115.85,16.67 ; 19.11,29.64 19.13,29.64 ; v2(115.87,16.72) arc(115.54,16.94) 115.14,17.02 98.66,17.02 arc(98.41,16.92) 98.3,16.67 98.3,8.84 arc(97.89,7.86) 96.91,7.45 76.29,7.45 arc(76.2,7.43) 76.13,7.38 76.12,7.37 arc(76.05,7.33) 75.97,7.31 75.33,7.31 arc(75.28,7.32) v2(75.25,7.34) ; v2(59.73,38.96) arc(59.7,38.99) 59.65,39 59.01,39 arc(58.93,38.98) 58.86,38.94 58.85,38.92 arc(58.78,38.87) 58.69,38.86 38.07,38.86 arc(37.09,38.45) 36.68,37.46 36.68,29.64 arc(36.57,29.39) 36.33,29.29 19.84,29.29 arc(19.44,29.37) v2(19.11,29.59)
C0: length 72.4
  Top Layer w0.102: 37.3,9.9 37.3,5.2 arc(37.56,4.57) 38.19,4.31 63.76,4.31 arc(63.93,4.38) 64,4.55 64,7.54 arc(64.16,7.92) 64.54,8.08 R11#2.1 ; 97.68,36.41 97.68,41.11 arc(97.42,41.73) 96.79,41.99 71.22,41.99 arc(71.05,41.92) 70.98,41.76 70.98,38.77 arc(70.82,38.38) 70.44,38.22 R11.1
C1: length 59.8
  Top Layer w0.102: 89.74,36.41 89.74,41.14 arc(89.57,41.53) 89.18,41.69 71.67,41.69 arc(71.4,41.58) 71.28,41.31 71.28,38.61 arc(71.02,38) 70.41,37.74 68.35,37.74 arc(68.33,37.74) R12.1 ; 45.24,9.9 45.24,5.17 arc(45.41,4.78) 45.8,4.61 63.31,4.61 arc(63.58,4.73) 63.7,5 63.7,7.69 arc(63.96,8.31) 64.58,8.57 66.63,8.57 arc(66.65,8.57) R12#2.1
C2: length 34.3
  Top Layer w0.102: 56.2,9.9 56.2,5.3 arc(56.31,5.03) 56.59,4.91 63,4.91 arc(63.28,5.03) 63.4,5.31 63.4,8.4 arc(63.59,8.86) 64.05,9.05 R13#2.2 ; R13.2 70.93,37.26 arc(71.39,37.45) 71.58,37.91 71.58,40.99 arc(71.7,41.28) 71.98,41.39 78.39,41.39 arc(78.67,41.28) 78.78,41.01 78.78,36.41
C3: length 91.4
  Top Layer w0.102: 68.31,38.73 68.32,38.73 ; 68.32,38.73 68.33,38.73 ; 68.32,38.73 arc(68.32,38.73) R10.1 arc(68.32,38.73) 68.33,38.73 ; 66.65,7.58 64.58,7.58 arc(64.38,7.5) 64.3,7.3 64.3,4.3 arc(64.22,4.1) 64.01,4.01 30.89,4.01 arc(30.05,4.36) 29.7,5.2 29.7,9.9 ; 66.65,7.58 66.66,7.58 ; 66.65,7.58 arc(66.66,7.58) R10#4.1 arc(66.67,7.58) 66.66,7.58 ; 105.28,36.41 105.28,41.11 arc(104.93,41.95) 104.09,42.29 70.97,42.29 arc(70.76,42.21) 70.68,42.01 70.68,39.01 arc(70.6,38.81) 70.4,38.73 68.33,38.73 ; 66.67,7.58 66.66,7.58
C4: length 100.7
  Top Layer w0.102: 111.48,36.41 111.48,41.61 arc(111.18,42.32) 110.47,42.62 70.52,42.62 arc(70.23,42.5) 70.11,42.21 R9.1 ; R9#2.1 64.87,4.1 arc(64.75,3.81) 64.46,3.69 24.51,3.69 arc(23.8,3.99) 23.5,4.7 23.5,9.9
L1: length 44.4
  Top Layer w0.102: 116.07,11.47 116.21,11.33 LED23#2.1 116.21,10.01 116.03,9.82 ; 116.07,11.47 116.21,11.61 LED8#2.1 ; 116.07,11.47 LED13#2.1 ; LED28.1 18.77,36.67 18.95,36.48 ; 18.95,36.48 18.77,36.3 LED23.1 18.77,34.97 18.91,34.84 ; 18.95,36.48 19.18,36.71 LED18.1 19.57,37.11 19.98,37.52 22.06,37.52 22.11,37.47 22.11,37.02 22.97,37.02 23.08,36.91 23.08,36.51 23.48,36.11 23.48,35.18 23.73,34.93 24.08,34.93 24.63,34.38 arc(24.74,34.21) 24.78,34.01 24.78,30.21 arc(24.62,29.82) 24.23,29.66 22.62,29.66 arc(22.32,29.78) 22.2,30.08 22.2,30.3 arc(22.17,30.38) 22.08,30.42 21.58,30.42 arc(21.51,30.39) 21.49,30.32 21.49,29.73 ; LED13.1 18.91,34.84 ; 18.91,34.84 18.77,34.7 LED8.1 ; 116.03,9.82 115.8,9.6 LED18#2.1 115.41,9.19 115,8.78 112.92,8.78 112.87,8.83 R15#2.2 112.02,9.28 111.9,9.4 111.9,9.8 111.5,10.2 111.5,11.13 111.25,11.38 110.9,11.38 110.35,11.93 arc(110.24,12.1) 110.2,12.29 110.2,16.1 arc(110.36,16.49) 110.75,16.65 112.36,16.65 arc(112.66,16.52) 112.78,16.22 112.78,16.01 arc(112.81,15.92) 112.9,15.89 113.4,15.89 arc(113.47,15.92) 113.49,15.99 113.49,16.57 ; 116.03,9.82 116.21,9.64 LED28#2.1
L2: length 51.2
  Top Layer w0.102: 117.81,10.74 118.03,10.95 v2(118.18,10.95) ; 117.81,10.74 LED24#2.1 118.36,11.47 118.76,11.87 120.37,11.87 120.42,11.93 120.8,11.93 120.97,12.1 LED14#2.1 121.57,12.74 121.77,12.54 LED3#2.1 122.26,12.27 122.78,11.75 LED19#2.1 ; 117.81,10.74 LED29#2.1 ; 17.17,35.57 LED29.1 ; 17.17,35.57 LED24.1 16.62,34.83 16.22,34.43 14.61,34.43 14.56,34.38 14.18,34.38 14.01,34.21 LED14.1 13.41,33.57 13.21,33.77 LED3.1 12.72,34.04 12.2,34.56 11.85,34.56 ; 17.17,35.57 16.95,35.36 v2(16.8,35.36) ; v2(114.45,10.98) 113.05,10.98 112.87,11.16 R16#2.2 112.86,11.57 112.33,11.57 111.87,12.04 111.24,12.04 arc(111.11,12.06) 110.99,12.14 110.8,12.33 arc(110.73,12.44) 110.7,12.57 110.7,15.82 arc(110.81,16.08) 111.07,16.19 112,16.19 arc(112.23,16.09) 112.32,15.87 112.32,15.63 arc(112.38,15.49) 112.52,15.43 113.97,15.43 arc(114.2,15.52) 114.3,15.75 114.3,16.57 ; v2(20.53,35.33) 21.93,35.33 22.11,35.14 22.11,34.74 22.12,34.73 22.65,34.73 23.11,34.27 23.74,34.27 arc(23.87,34.24) 23.99,34.17 24.18,33.98 arc(24.25,33.87) 24.28,33.73 24.28,30.49 arc(24.17,30.23) 23.91,30.12 22.98,30.12 arc(22.75,30.21) 22.66,30.44 22.66,30.68 arc(22.6,30.82) 22.46,30.88 21.01,30.88 arc(20.78,30.78) 20.69,30.56 20.69,29.73
  Bottom Layer w0.102: v2(114.45,10.98) 114.75,11.28 117.86,11.28 v2(118.18,10.95) ; v2(20.53,35.33) 20.23,35.03 17.12,35.03 v2(16.8,35.36)
L3: length 47.4
  Top Layer w0.102: 119.37,11.15 119.17,10.95 v2(118.83,10.95) ; 119.37,11.15 119.58,10.94 LED20#2.1 120.17,10.58 119.98,10.4 ; 119.37,11.15 LED25#2.1 ; 114.7,16.57 114.7,15.5 arc(114.61,15.29) 114.4,15.2 112.39,15.2 arc(112.18,15.29) 112.09,15.5 112.09,15.71 arc(112.02,15.88) 111.84,15.95 111.21,15.95 arc(111.03,15.88) 110.95,15.69 110.95,12.7 arc(110.96,12.65) 110.99,12.61 111.16,12.44 arc(111.34,12.32) 111.55,12.28 112.43,12.28 R17#2.2 113.45,12.13 v2(114.37,12.13) ; LED9.1 14.81,36.09 ; 14.81,36.09 14.63,35.91 LED4.1 ; 14.81,36.09 15,35.91 ; 120.17,10.22 120.35,10.4 LED4#2.1 ; 120.17,10.22 LED9#2.1 ; 120.17,10.22 119.98,10.4 ; LED30.1 15,35.91 ; 15,35.91 14.81,35.72 LED20.1 15.4,35.37 15.61,35.16 ; 15.61,35.16 15.81,35.36 v2(16.16,35.36) ; 15.61,35.16 LED25.1 ; 119.98,10.4 119.37,10.4 ; v2(20.61,34.18) 21.53,34.18 22.11,33.59 22.55,34.03 23.44,34.03 arc(23.64,33.99) 23.82,33.87 23.99,33.69 arc(24.02,33.65) 24.03,33.61 24.03,30.62 arc(23.95,30.43) 23.77,30.35 23.14,30.35 arc(22.96,30.42) 22.89,30.6 22.89,30.81 arc(22.8,31.02) 22.59,31.11 20.58,31.11 arc(20.37,31.02) 20.29,30.81 20.29,29.73
  Bottom Layer w0.102: v2(16.16,35.36) 16.79,34.73 20.06,34.73 v2(20.61,34.18) ; v2(114.37,12.13) 114.92,11.58 118.19,11.58 v2(118.83,10.95)
L4: length 63.9
  Top Layer w0.102: 8.86,35.74 LED15.1 9.42,35.37 9.66,35.13 LED26.1 ; 8.86,35.74 9.03,35.91 LED5.1 10.34,35.91 ; 8.86,35.74 8.69,35.91 LED10.1 ; 10.34,35.91 10.38,35.91 10.65,36.18 LED31.1 ; 10.34,35.91 v2(10.7,35.55) ; 126.12,10.57 125.95,10.4 LED5#2.1 124.64,10.4 ; 126.12,10.57 126.29,10.4 LED10#2.1 ; 126.12,10.57 LED15#2.1 125.56,10.94 125.32,11.17 LED26#2.1 ; 22.48,35.48 v2(22.78,35.48) 22.78,35.18 ; 22.48,35.48 22.78,35.18 ; 22.48,35.48 22.11,35.84 22.11,35.88 ; 124.64,10.4 124.6,10.4 124.33,10.13 LED31#2.1 ; 124.64,10.4 v2(124.28,10.76) ; 112.2,11.13 v2(112.2,10.83) 112.5,10.83 ; 112.2,11.13 112.5,10.83 ; 112.2,11.13 111.65,11.68 111,11.68 110.63,12.05 arc(110.5,12.25) 110.45,12.48 110.45,15.9 arc(110.6,16.26) 110.97,16.42 112.2,16.42 arc(112.45,16.31) 112.55,16.07 112.55,15.86 arc(112.61,15.72) 112.75,15.66 113.64,15.66 arc(113.82,15.73) 113.89,15.92 113.89,16.57 ; 112.5,10.83 112.87,10.46 R18#2.2 ; 22.78,35.18 23.33,34.63 23.98,34.63 24.35,34.25 arc(24.48,34.06) 24.53,33.83 24.53,30.41 arc(24.38,30.04) 24.01,29.89 22.78,29.89 arc(22.53,29.99) 22.43,30.24 22.43,30.45 arc(22.37,30.59) 22.23,30.65 21.34,30.65 arc(21.16,30.57) 21.09,30.39 21.09,29.73
  Bottom Layer w0.102: v2(10.7,35.55) 11.23,36.08 15.68,36.08 16.33,36.73 19.73,36.73 20.43,36.03 22.64,36.03 22.78,35.89 v2(22.78,35.48) ; v2(124.28,10.76) 123.75,10.23 119.3,10.23 118.65,9.58 115.25,9.58 114.55,10.28 112.34,10.28 112.2,10.42 v2(112.2,10.83)
L5: length 73.8
  Top Layer w0.102: LED21.1 7.44,33.57 7.26,33.76 ; 7.26,34.03 7.26,33.76 ; 7.26,33.76 7.08,33.58 6.18,33.58 ; 5.71,33.73 5.53,33.55 4.93,33.55 LED6.1 ; 5.71,33.73 5.86,33.58 6.18,33.58 ; 5.71,33.73 LED11.1 ; v2(128.45,12.38) 128.8,12.73 ; 128.8,12.73 129.12,12.73 129.27,12.58 ; 128.8,12.73 127.9,12.73 127.72,12.55 ; 110.84,11.04 110.09,11.79 arc(109.98,11.96) 109.94,12.15 109.94,16.3 arc(110.11,16.71) 110.51,16.88 112.79,16.88 arc(113.01,16.79) 113.09,16.57 ; 110.84,11.04 v2(111.05,10.83) 110.84,10.62 ; 110.84,11.04 110.84,10.62 ; 24.14,35.69 R19.2 ; 24.14,35.69 v2(23.93,35.48) 24.14,35.27 ; 24.14,35.69 24.14,35.27 ; LED32.1 v2(8.06,36.47) ; LED11#2.1 129.27,12.58 ; 129.27,12.58 129.45,12.75 130.05,12.75 LED6#2.1 ; 127.72,12.55 127.54,12.74 LED21#2.1 ; 127.72,12.55 LED16#2.1 ; 24.14,35.27 24.89,34.52 arc(25,34.35) 25.04,34.15 25.04,30.01 arc(24.87,29.6) 24.47,29.43 22.19,29.43 arc(21.97,29.52) 21.89,29.73 ; 110.84,10.62 R19#2.2 ; 6.18,33.58 v2(6.53,33.93) ; LED32#2.1 v2(126.92,9.84)
  Bottom Layer w0.102: v2(6.53,33.93) 6.53,34.94 v2(8.06,36.47) 8.82,37.23 10.88,37.23 11.53,36.58 15.38,36.58 16.03,37.23 22.08,37.23 22.93,36.38 23.58,36.38 23.93,36.02 v2(23.93,35.48) ; v2(111.05,10.83) 111.05,10.28 111.4,9.93 112.05,9.93 112.9,9.08 118.95,9.08 119.6,9.73 123.45,9.73 124.1,9.08 126.16,9.08 v2(126.92,9.84) 128.45,11.37 v2(128.45,12.38)
L6: length 77.2
  Top Layer w0.102: 25.29,34.02 25.29,29.71 arc(25.12,29.3) 24.71,29.13 24.18,29.13 ; 25.29,34.02 25.29,34.32 ; 25.29,34.02 arc(25.29,34.02) 25.29,34.02 ; v2(6.38,36.71) LED17.1 5.71,37.55 5.53,37.73 4.28,37.73 4.11,37.55 LED27.1 LED12.1 3.54,35.37 ; LED7.1 3.3,35.13 3.54,35.37 ; 25.29,34.32 25.29,34.55 ; 25.29,34.32 arc(25.29,34.32) 25.29,34.31 ; 25.29,34.55 25.29,36.19 ; 25.29,34.55 arc(25.26,34.66) 25.2,34.75 24.73,35.22 v2(24.73,35.48) ; 109.69,12.28 109.69,11.98 ; 109.69,12.28 109.69,16.6 arc(109.86,17.01) 110.27,17.18 110.8,17.18 ; 109.69,12.28 arc(109.69,12.28) 109.69,12.28 ; 109.69,11.76 109.69,10.11 ; 109.69,11.76 109.69,11.98 ; 109.69,11.76 arc(109.72,11.65) 109.78,11.56 110.25,11.08 v2(110.25,10.83) ; 109.69,11.98 arc(109.69,11.99) 109.69,11.99 ; 131.44,10.94 LED12#2.1 LED27#2.1 130.87,8.75 130.7,8.58 129.45,8.58 129.27,8.75 LED17#2.1 v2(128.6,9.6) ; 131.44,10.94 131.68,11.17 131.68,11.47 ; 131.44,10.94 131.67,10.7 LED22#2.1 ; 110.8,17.18 112.49,17.18 ; 110.8,17.18 arc(110.83,17.18) 110.86,17.18 ; 24.18,29.13 22.49,29.13 ; 24.18,29.13 arc(24.15,29.13) 24.12,29.13 ; LED22.1 3.31,35.61 3.54,35.37
  Bottom Layer w0.102: v2(128.6,9.6) 128.07,9.6 127.05,8.58 111.15,8.58 110.25,9.48 v2(110.25,10.83) ; v2(6.38,36.71) 6.91,36.71 7.93,37.73 23.83,37.73 24.73,36.83 v2(24.73,35.48)
LED_R: length 36.4
  Top Layer w0.127: v2(143.23,10.2) 143.5,10.48 arc(143.99,11.22) 144.17,12.09 144.17,12.89 arc(144.28,13.16) 144.55,13.27 145.27,13.27 arc(145.74,13.47) 145.94,13.94 145.94,17.7 arc(145.74,18.68) 145.19,19.5 v2(143.42,21.27) ; v2(140.58,35.87) 138.81,34.1 arc(137.98,33.55) 137.01,33.36 133.25,33.36 arc(132.77,33.55) 132.58,34.02 132.58,34.74 arc(132.47,35.01) 132.2,35.12 131.4,35.12 arc(130.53,35.3) 129.79,35.79 v2(129.51,36.07)
  Bottom Layer w0.127: U2#4.18 129.51,35.98 ; R4#3.1 144.08,18.24 arc(143.81,18.65) 143.71,19.12 143.71,19.13 arc(143.74,19.26) 143.81,19.37 143.91,19.46 arc(143.99,19.58) 144.01,19.72 arc(143.97,19.96) 143.83,20.16 143.67,20.32 arc(143.49,20.6) 143.42,20.92 v2(143.42,21.27) ; v2(140.58,35.87) 140.23,35.87 arc(139.91,35.8) 139.63,35.62 139.47,35.46 arc(139.27,35.32) 139.03,35.28 arc(138.89,35.3) 138.77,35.38 138.67,35.48 arc(138.56,35.55) 138.43,35.58 138.43,35.58 arc(137.95,35.48) 137.55,35.21 R4#4.1 ; U2#3.18 143.31,10.2
LED_W1: length 34.4
  Top Layer w0.127: v2(145.15,35.87) 142.05,32.77 arc(141.22,32.21) 140.25,32.02 132.01,32.02 arc(131.84,32.06) v2(131.69,32.15) ; v2(143.42,25.84) 146.52,22.74 arc(147.08,21.91) 147.27,20.94 147.27,12.7 arc(147.23,12.53) v2(147.14,12.38)
  Bottom Layer w0.127: R9#3.1 144.29,25.83 arc(144.12,25.72) 143.92,25.68 143.88,25.68 arc(143.64,25.72) v2(143.42,25.84) ; R9#4.1 145.14,35 arc(145.02,35.17) 144.98,35.38 144.98,35.41 arc(145.02,35.65) v2(145.15,35.87) ; U2#3.7 arc(146.5,12.51) 146.81,12.52 arc(146.98,12.47) v2(147.14,12.38) ; v2(131.69,32.15) arc(131.77,32.31) 131.83,32.48 arc(131.82,32.79) U2#4.7
LED_W2: length 38.9
  Top Layer w0.127: v2(143.23,9.55) 143.73,10.06 arc(144.28,10.88) 144.47,11.86 144.47,12.7 arc(144.56,12.91) 144.78,13 145.28,13 arc(145.93,13.27) 146.2,13.93 146.2,18.23 arc(146.01,19.2) 145.46,20.03 v2(143.42,22.06) ; v2(128.86,36.07) 129.37,35.56 arc(130.19,35.01) 131.16,34.82 132.01,34.82 arc(132.22,34.73) 132.31,34.51 132.31,34.01 arc(132.58,33.36) 133.23,33.09 137.54,33.09 arc(138.51,33.28) 139.34,33.83 v2(141.37,35.87)
  Bottom Layer w0.127: R5#3.1 144.48,19.63 arc(144.4,20.04) 144.17,20.39 144.04,20.52 arc(143.91,20.72) 143.86,20.95 143.86,21.62 arc(143.72,21.92) v2(143.42,22.06) ; R5#4.1 138.94,34.81 arc(139.35,34.89) 139.7,35.12 139.83,35.25 arc(140.02,35.38) 140.26,35.43 140.93,35.43 arc(141.22,35.57) v2(141.37,35.87) ; U2#3.17 v2(143.23,9.55) ; U2#4.17 v2(128.86,36.07)
LED_W3: length 40.8
  Top Layer w0.127: v2(128.21,36.07) 129.02,35.26 arc(129.84,34.71) 130.82,34.51 131.81,34.51 arc(131.97,34.44) 132.04,34.27 132.04,34.01 arc(132.39,33.17) 133.23,32.82 138.07,32.82 arc(139.04,33.01) 139.87,33.57 v2(142.17,35.87) ; v2(143.42,22.86) 145.73,20.56 arc(146.28,19.73) 146.47,18.76 146.47,13.93 arc(146.12,13.09) 145.28,12.74 145.02,12.74 arc(144.85,12.67) 144.78,12.5 144.78,11.51 arc(144.59,10.54) 144.03,9.71 v2(143.23,8.9)
  Bottom Layer w0.127: v2(142.17,35.87) 142.17,35.81 141.82,35.46 arc(141.09,34.98) R6#4.1 ; v2(143.42,22.86) 143.48,22.86 143.83,22.51 arc(144.31,21.78) R6#3.1 ; U2#4.16 v2(128.21,36.07) ; U2#3.16 v2(143.23,8.9)
LED_W4: length 38.8
  Top Layer w0.127: v2(146.41,9.17) 146.28,9.3 arc(145.73,10.12) 145.54,11.09 145.54,11.65 arc(145.61,11.98) 145.79,12.27 146.2,12.67 arc(146.6,13.26) 146.74,13.97 146.74,19.29 arc(146.54,20.26) 145.99,21.09 v2(143.42,23.66) ; v2(142.96,35.87) 140.39,33.3 arc(139.57,32.75) 138.6,32.56 133.27,32.56 arc(132.57,32.69) 131.98,33.09 131.57,33.5 arc(131.29,33.68) 130.96,33.75 130.4,33.75 arc(129.43,33.56) 128.6,33.01 v2(128.47,32.88)
  Bottom Layer w0.127: v2(146.41,9.17) 146.52,9.27 arc(146.7,9.55) 146.77,9.88 146.77,9.9 arc(146.72,10.15) 146.58,10.36 ; v2(128.47,32.88) 128.58,32.77 arc(128.86,32.59) 129.19,32.52 129.21,32.52 arc(129.46,32.57) U2#4.11 ; R7#4.1 141.94,34.84 v2(142.96,35.87) arc(143.03,35.83) 143.1,35.85 ; R7#3.1 144.45,22.63 v2(143.42,23.66) arc(143.46,23.72) 143.44,23.8
LED_W5: length 43.6
  Top Layer w0.127: v2(128.13,32.18) 128.44,32.18 arc(128.9,32.27) 129.29,32.53 arc(129.96,32.98) 130.76,33.14 130.97,33.14 arc(131.43,33.05) 131.83,32.78 arc(132.38,32.42) 133.03,32.29 139.6,32.29 arc(140.57,32.48) 141.4,33.03 v2(144.23,35.87) ; v2(147.11,8.82) 147.11,9.13 arc(147.02,9.59) 146.76,9.98 arc(146.31,10.65) 146.15,11.45 146.15,11.66 arc(146.24,12.13) 146.51,12.52 arc(146.87,13.07) 147,13.72 147,20.29 arc(146.81,21.27) 146.26,22.09 v2(143.42,24.93)
  Bottom Layer w0.127: R8#3.1 144.17,24.64 arc(143.82,24.86) v2(143.42,24.93) ; 129.96,32.18 v2(128.13,32.18) ; v2(147.11,8.82) 147.11,10.65 arc(147.04,11.01) U2#3.10 ; R8#4.1 143.95,35.12 arc(144.16,35.47) v2(144.23,35.87) ; U2#4.10 arc(130.32,32.25) 129.96,32.18
